# Altium schematic sheet SSD M.2_B-Key.SchDoc
size A3; SheetNumber: 6; SheetTotal: 21
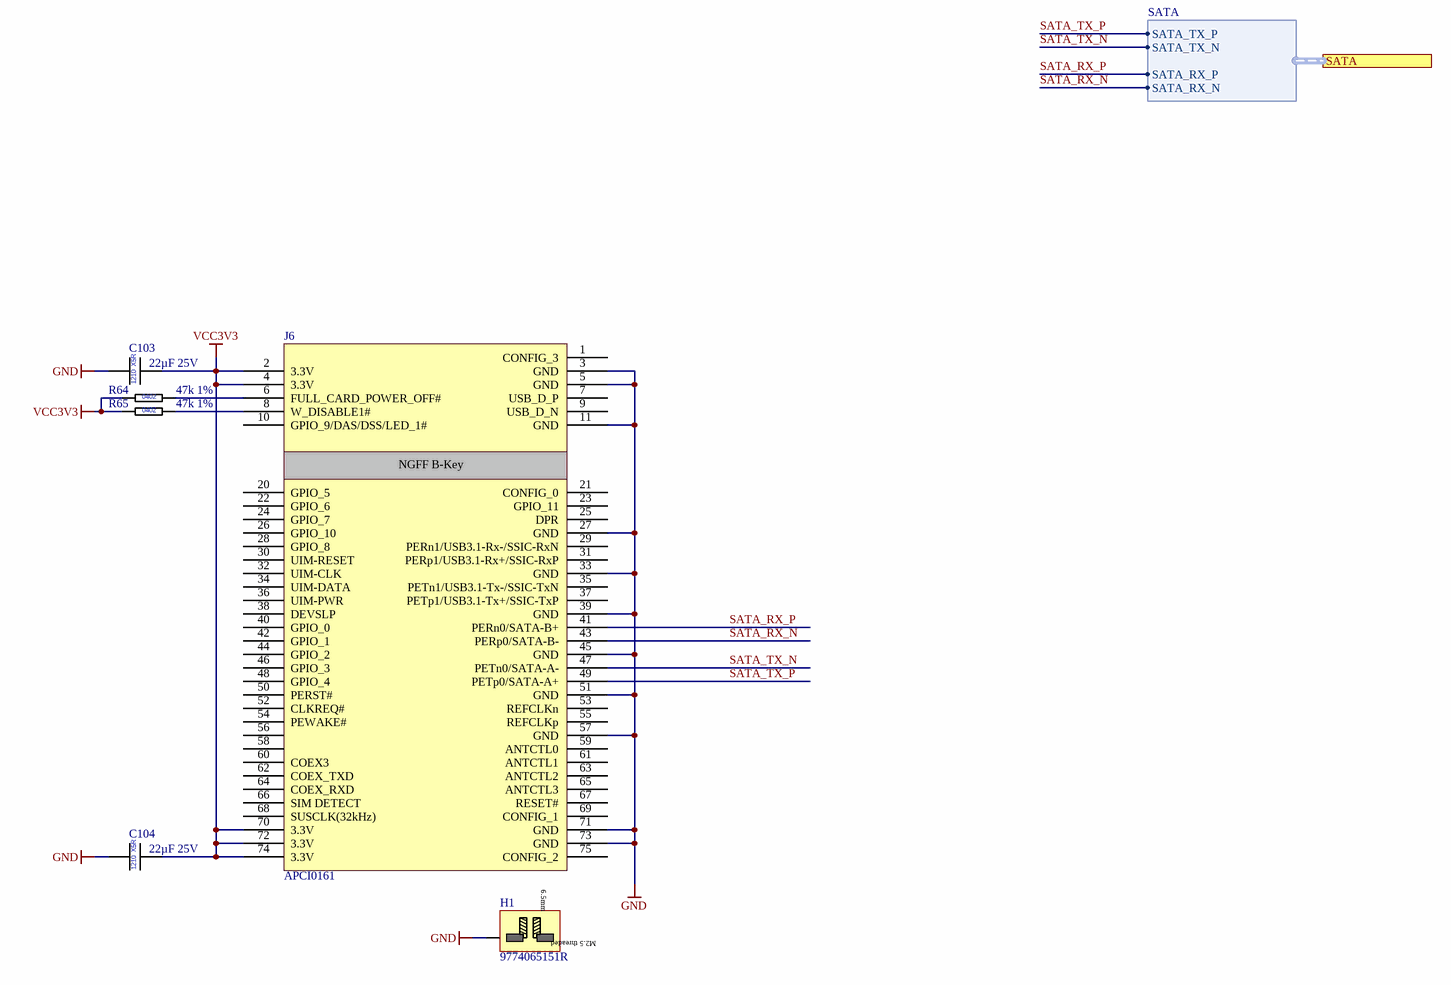
[diagram p0: SSD M.2_B-Key.SchDoc]

## Parts
C103  22µF 25V  [CAP_1210]
C104  22µF 25V  [CAP_1210]
H1  9774065151R  [9774065151R]
J6  APCI0161  [APCI0161-P001A]
R64  47k 1%  [RES_0402_L]
R65  47k 1%  [RES_0402_L]

## Ports
SATA (harness SATA, see Top-Level-Sheet[6B], MGT Banks 115-116[8C])

## Harnesses
SATA: SATA_TX_P, SATA_TX_N, SATA_RX_P, SATA_RX_N

## Nets
GND: C103.1 C104.1 H1.1 J6.3(GND) J6.5(GND) J6.11(GND) J6.27(GND) J6.33(GND) J6.39(GND) J6.45(GND) J6.51(GND) J6.57(GND) J6.71(GND) J6.73(GND)
VCC3V3: C103.2 C104.2 J6.2(3.3V) J6.4(3.3V) J6.70(3.3V) J6.72(3.3V) J6.74(3.3V) R64.1 R65.1
SATA_RX_N: J6.43(PERp0/SATA-B-) ; port SATA.SATA_RX_N
SATA_RX_P: J6.41(PERn0/SATA-B+) ; port SATA.SATA_RX_P
SATA_TX_N: J6.47(PETn0/SATA-A-) ; port SATA.SATA_TX_N
SATA_TX_P: J6.49(PETp0/SATA-A+) ; port SATA.SATA_TX_P
NetJ6_6: J6.6(FULL_CARD_POWER_OFF#) R64.2
NetJ6_8: J6.8(W_DISABLE1#) R65.2

Not connected (* = marked no-connect by the designer): J6 1(CONFIG_3) 7(USB_D_P) 9(USB_D_N) 10(GPIO_9/DAS/DSS/LED_1#) 20(GPIO_5) 21(CONFIG_0) 22(GPIO_6) 23(GPIO_11) 24(GPIO_7) 25(DPR) 26(GPIO_10) 28(GPIO_8) 29(PERn1/USB3.1-Rx-/SSIC-RxN) 30(UIM-RESET) 31(PERp1/USB3.1-Rx+/SSIC-RxP) 32(UIM-CLK) 34(UIM-DATA) 35(PETn1/USB3.1-Tx-/SSIC-TxN) 36(UIM-PWR) 37(PETp1/USB3.1-Tx+/SSIC-TxP) 38(DEVSLP) 40(GPIO_0) 42(GPIO_1) 44(GPIO_2) 46(GPIO_3) 48(GPIO_4) 50(PERST#) 52(CLKREQ#) 53(REFCLKn) 54(PEWAKE#) 55(REFCLKp) 56 58 59(ANTCTL0) 60(COEX3) 61(ANTCTL1) 62(COEX_TXD) 63(ANTCTL2) 64(COEX_RXD) 65(ANTCTL3) 66(SIM_DETECT) 67(RESET#) 68(SUSCLK(32kHz)) 69(CONFIG_1) 75(CONFIG_2)

## Notes on the sheet
- Title:
- ++CONFIDENTIAL++
- Datum:
- Blatt:
- von:
- Zeit:
- Entwickler:
- Elektronik- und Softwareentwicklung aus Nürnberg
- The  information  contained  in  these  documents  is  confidential,  privileged  and  only  for  the
  information of the intended recipient and may
  not be used, published or redistributed without
  the prior written consent from PCB Arts GmbH.
- Revision:
- Checked:
- https://pcb-arts.com/
- mail@pcb-arts.com
- (in symbol APCI0161-NGFF B-Key Card Edge Connector 8.5mm Height) NGFF B-Key
- (in symbol CAP_1210_22µF_25V) X5R; 1210
- (in symbol RES_0402_47k_1%) 0402
- (in symbol Würth Standoff M2.5 h:6.5mm) 6.5mm; M2.5 threaded

## Library data of the parts
C103 C104 = CAP_1210_22µF_25V: Multilayer Ceramic Capacitors MLCC - SMD/SMT 1210 25VDC; Manufacturer 1: KEMET; Manufacturer 1 Prt. Nr.: C1210C226K3PACTU; Manufacturer 2 Prt. Nr.: TMK212BBJ226MG-TT; Manufacturer 2: Taiyo Yuden
H1 = Würth Standoff M2.5 h:6.5mm: Würth Standoff M2.5 h:6.5mm 9774065151R; Manufacturer 1: Würth Elektronik; Manufacturer 1 Prt. Nr.: 9774065151R
J6 = APCI0161-NGFF B-Key Card Edge Connector 8.5mm Height: NGFF B-Key Card Edge Connector 8.5mm Height; Manufacturer 1: Lotes; Manufacturer 1 Prt. Nr.: APCI0161
R64 R65 = RES_0402_47k_1%: Thick Film Resistors - SMD 47kOhm 1%; Manufacturer 1: Vishay / Dale; Manufacturer 1 Prt. Nr.: CRCW040247K0FKEDC; Manufacturer 2 Prt. Nr.: RC0402FR-7W47KL; Manufacturer 2: Yageo